# Altium schematic sheet UI_and_IO-Connectors.SchDoc
size A3; SheetNumber: 4; SheetTotal: 8; DocumentSheetName: I/O
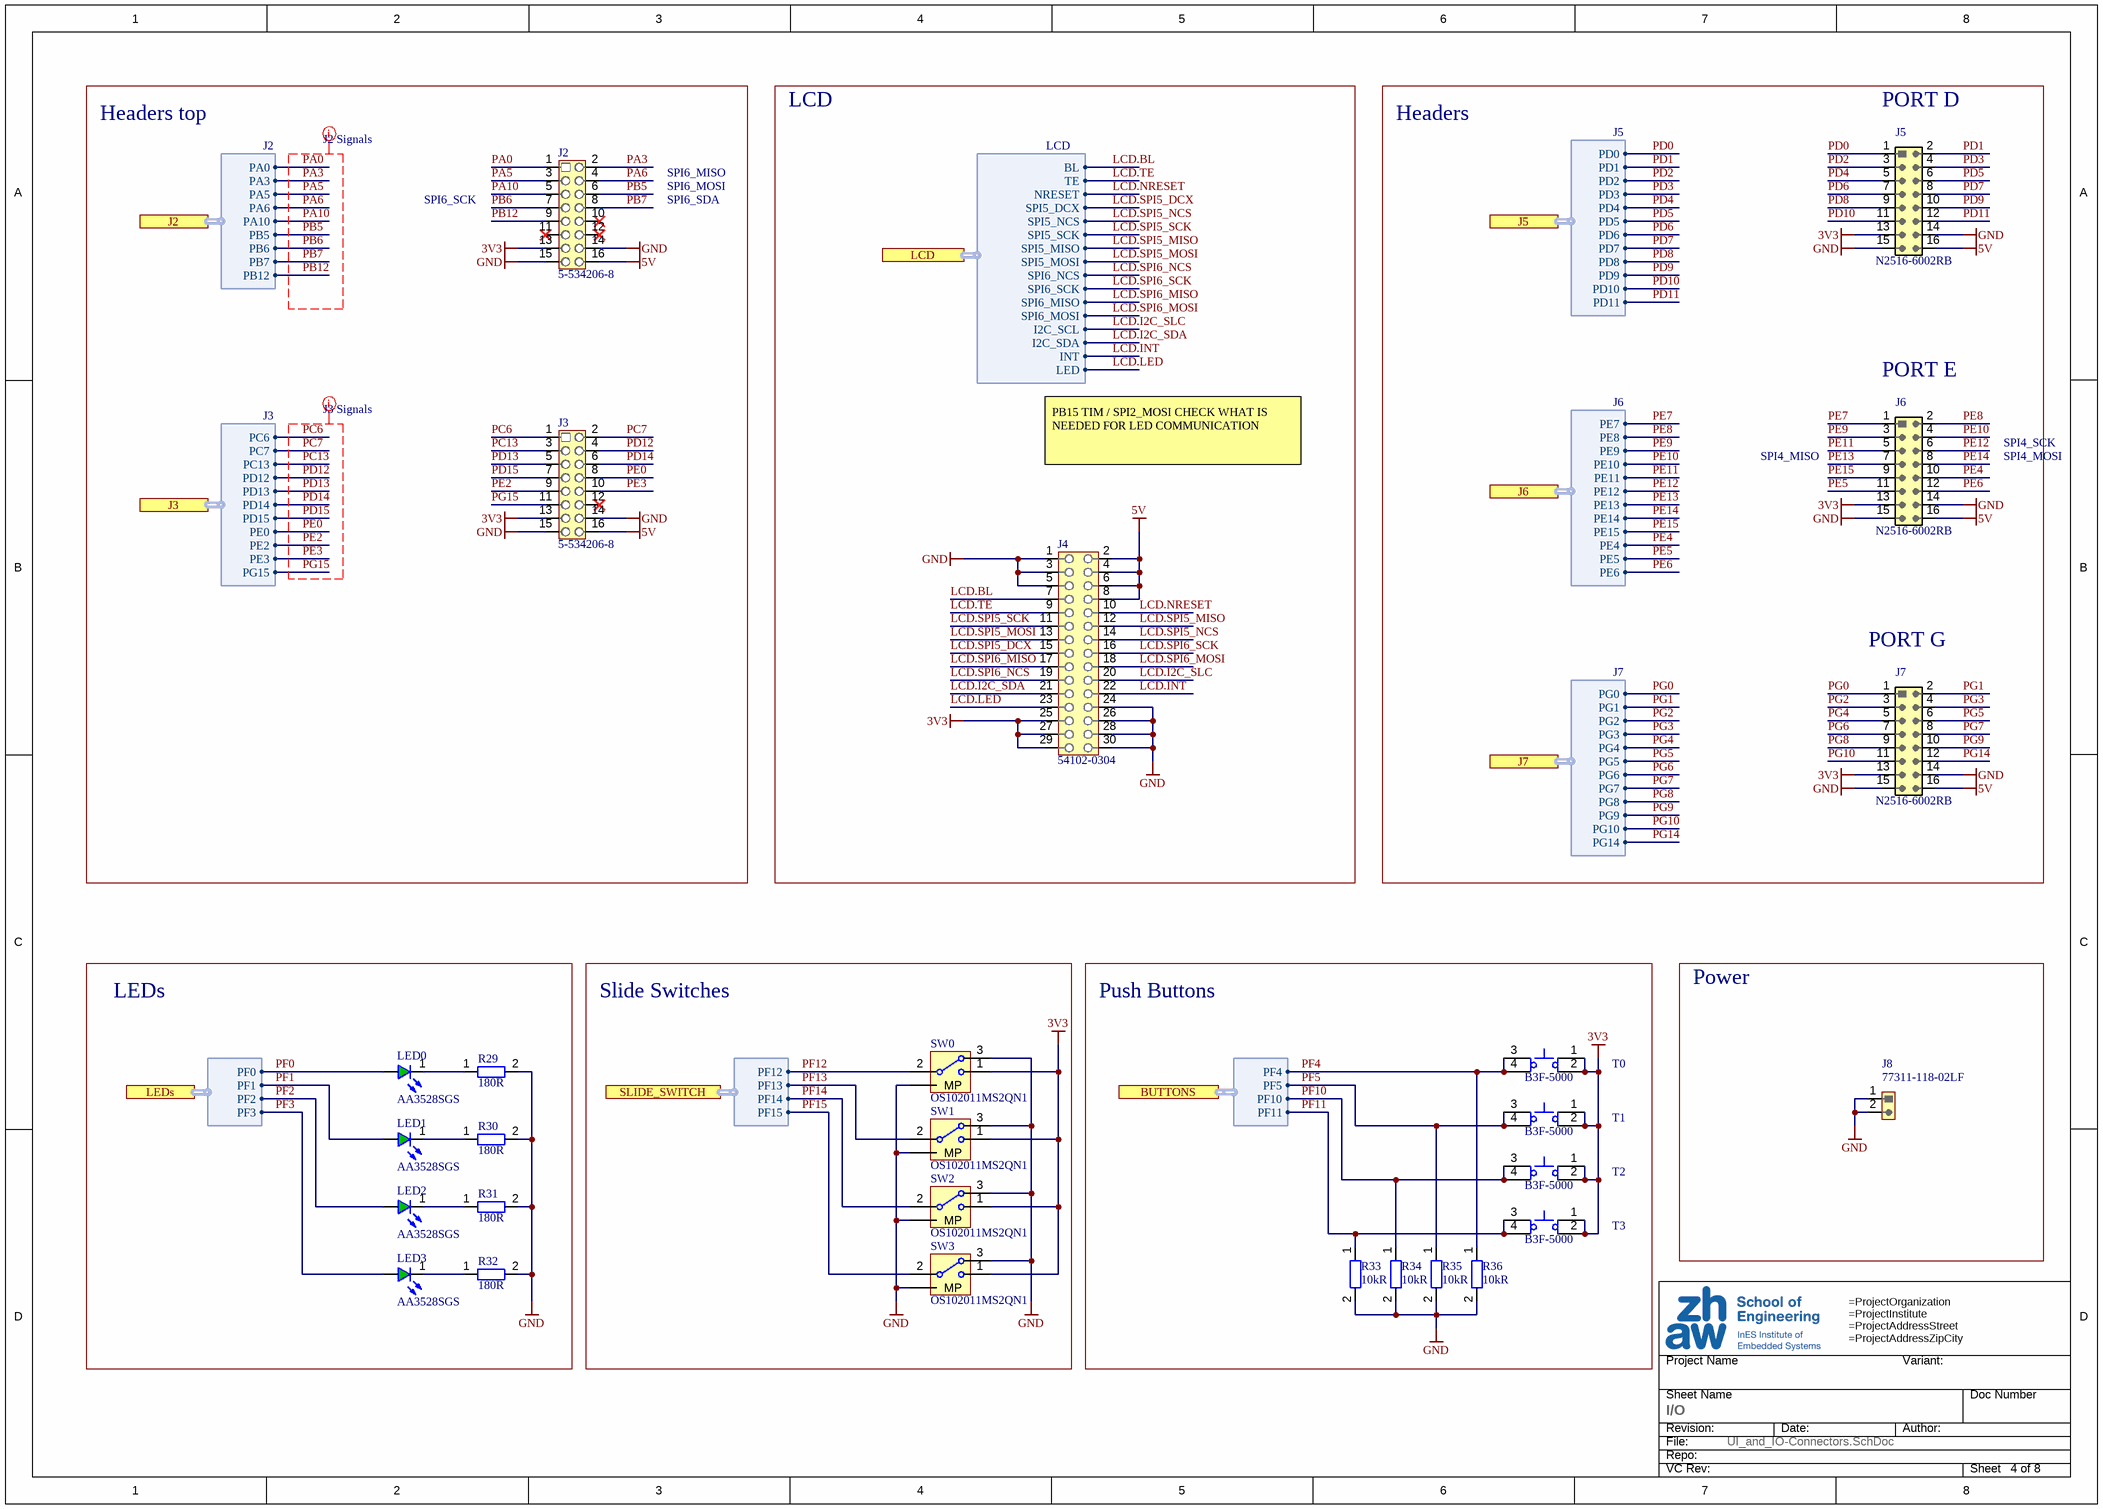
[diagram p0: UI_and_IO-Connectors.SchDoc]

## Parts
J2  5-534206-8  [HD254_2x8_FV_THT]
J3  5-534206-8  [HD254_2x8_FV_THT]
J4  54102-0304  [MOLEX_54102-0304]
J5  N2516-6002RB  [3M-N2516-6002RB]
J6  N2516-6002RB  [3M-N2516-6002RB]
J7  N2516-6002RB  [3M-N2516-6002RB]
J8  77311-118-02LF  [HD254 _1x2_MV]
LED0  AA3528SGS  [LEDM350X280X190-2]
LED1  AA3528SGS  [LEDM350X280X190-2]
LED2  AA3528SGS  [LEDM350X280X190-2]
LED3  AA3528SGS  [LEDM350X280X190-2]
R29  180R  [RESC1608X45N]
R30  180R  [RESC1608X45N]
R31  180R  [RESC1608X45N]
R32  180R  [RESC1608X45N]
R33  10kR  [RESC1005X35N]
R34  10kR  [RESC1005X35N]
R35  10kR  [RESC1005X35N]
R36  10kR  [RESC1005X35N]
SW0  OS102011MS2QN1  [SW_OS102011MS2QN1]
SW1  OS102011MS2QN1  [SW_OS102011MS2QN1]
SW2  OS102011MS2QN1  [SW_OS102011MS2QN1]
SW3  OS102011MS2QN1  [SW_OS102011MS2QN1]
T0  B3F-5000  [SW_B3F-5000]
T1  B3F-5000  [SW_B3F-5000]
T2  B3F-5000  [SW_B3F-5000]
T3  B3F-5000  [SW_B3F-5000]

## Blocks framed on the sheet
Headers top: J2 J3
LCD: J4
LEDs: LED0-LED3 R29-R32
Slide Switches: SW0-SW3
Push Buttons: R33-R36 T0-T3
Power: J8

## Ports
BUTTONS (harness BUTTONS), J2 (harness J2), J3 (harness J3), J5 (harness J5), J6 (harness J6), J7 (harness J7), LCD (harness LCD), LEDs (harness LEDs), SLIDE_SWITCH (harness SLIDE_SWITCH)

## Harnesses
LCD: SPI5_DCX, SPI5_SCK, SPI5_MISO, SPI5_MOSI, SPI5_NCS, SPI6_NCS, TE, SPI6_SCK, SPI6_MOSI, SPI6_MISO, NRESET, I2C_SCL, I2C_SDA, INT, BL, LED
J2: PA0, PA3, PA5, PA6, PA10, PB5, PB6, PB12, PB7
J3: PG15, PC6, PC7, PC13, PD12, PD13, PD14, PD15, PE0, PE2, PE3
J5: PD0, PD1, PD2, PD3, PD4, PD5, PD6, PD7, PD8, PD9, PD10, PD11
J6: PE7, PE8, PE9, PE10, PE11, PE12, PE13, PE14, PE15, PE4, PE5, PE6
J7: PG0, PG1, PG2, PG3, PG4, PG5, PG6, PG7, PG8, PG9, PG10, PG14
LEDs: PF0, PF1, PF2, PF3
SLIDE_SWITCH: PF12, PF13, PF14, PF15
BUTTONS: PF4, PF5, PF10, PF11

## Nets
3V3: J2.13 J3.13 J4.25 J4.27 J4.29 J5.13 J6.13 J7.13 SW0.1(Signal) SW1.1(Signal) SW2.1(Signal) SW3.1(Signal) T0.1 T0.2 T1.1 T1.2 T2.1 T2.2 T3.1 T3.2
5V: J2.16 J3.16 J4.2 J4.4 J4.6 J4.8 J5.16 J6.16 J7.16
GND: J2.14 J2.15 J3.14 J3.15 J4.1 J4.3 J4.5 J4.24 J4.26 J4.28 J4.30 J5.14 J5.15 J6.14 J6.15 J7.14 J7.15 J8.1 J8.2 R29.2 R30.2 R31.2 R32.2 R33.2 R34.2 R35.2 R36.2 SW0.3(Signal) SW0.MP SW1.3(Signal) SW1.MP SW2.3(Signal) SW2.MP SW3.3(Signal) SW3.MP
LCD.BL: J4.7 ; port LCD.BL
LCD.I2C_SDA: J4.21 ; port LCD.I2C_SDA
LCD.I2C_SLC: J4.20 ; port LCD.I2C_SCL
LCD.INT: J4.22 ; port LCD.INT
LCD.LED: J4.23 ; port LCD.LED
LCD.NRESET: J4.10 ; port LCD.NRESET
LCD.SPI5_DCX: J4.15 ; port LCD.SPI5_DCX
LCD.SPI5_MISO: J4.12 ; port LCD.SPI5_MISO
LCD.SPI5_MOSI: J4.13 ; port LCD.SPI5_MOSI
LCD.SPI5_NCS: J4.14 ; port LCD.SPI5_NCS
LCD.SPI5_SCK: J4.11 ; port LCD.SPI5_SCK
LCD.SPI6_MISO: J4.17 ; port LCD.SPI6_MISO
LCD.SPI6_MOSI: J4.18 ; port LCD.SPI6_MOSI
LCD.SPI6_NCS: J4.19 ; port LCD.SPI6_NCS
LCD.SPI6_SCK: J4.16 ; port LCD.SPI6_SCK
LCD.TE: J4.9 ; port LCD.TE
PA0: J2.1 ; port J2.PA0
PA3: J2.2 ; port J2.PA3
PA5: J2.3 ; port J2.PA5
PA6: J2.4 ; port J2.PA6
PA10: J2.5 ; port J2.PA10
PB5: J2.6 ; port J2.PB5
PB6: J2.7 ; port J2.PB6
PB7: J2.8 ; port J2.PB7
PB12: J2.9 ; port J2.PB12
PC6: J3.1 ; port J3.PC6
PC7: J3.2 ; port J3.PC7
PC13: J3.3 ; port J3.PC13
PD0: J5.1 ; port J5.PD0
PD1: J5.2 ; port J5.PD1
PD2: J5.3 ; port J5.PD2
PD3: J5.4 ; port J5.PD3
PD4: J5.5 ; port J5.PD4
PD5: J5.6 ; port J5.PD5
PD6: J5.7 ; port J5.PD6
PD7: J5.8 ; port J5.PD7
PD8: J5.9 ; port J5.PD8
PD9: J5.10 ; port J5.PD9
PD10: J5.11 ; port J5.PD10
PD11: J5.12 ; port J5.PD11
PD12: J3.4 ; port J3.PD12
PD13: J3.5 ; port J3.PD13
PD14: J3.6 ; port J3.PD14
PD15: J3.7 ; port J3.PD15
PE0: J3.8 ; port J3.PE0
PE2: J3.9 ; port J3.PE2
PE3: J3.10 ; port J3.PE3
PE4: J6.10 ; port J6.PE4
PE5: J6.11 ; port J6.PE5
PE6: J6.12 ; port J6.PE6
PE7: J6.1 ; port J6.PE7
PE8: J6.2 ; port J6.PE8
PE9: J6.3 ; port J6.PE9
PE10: J6.4 ; port J6.PE10
PE11: J6.5 ; port J6.PE11
PE12: J6.6 ; port J6.PE12
PE13: J6.7 ; port J6.PE13
PE14: J6.8 ; port J6.PE14
PE15: J6.9 ; port J6.PE15
PF0: LED0.2(A) ; port LEDs.PF0
PF1: LED1.2(A) ; port LEDs.PF1
PF2: LED2.2(A) ; port LEDs.PF2
PF3: LED3.2(A) ; port LEDs.PF3
PF4: R36.1 T0.3 T0.4 ; port BUTTONS.PF4
PF5: R35.1 T1.3 T1.4 ; port BUTTONS.PF5
PF10: R34.1 T2.3 T2.4 ; port BUTTONS.PF10
PF11: R33.1 T3.3 T3.4 ; port BUTTONS.PF11
PF12: SW0.2(COM) ; port SLIDE_SWITCH.PF12
PF13: SW1.2(COM) ; port SLIDE_SWITCH.PF13
PF14: SW2.2(COM) ; port SLIDE_SWITCH.PF14
PF15: SW3.2(COM) ; port SLIDE_SWITCH.PF15
PG0: J7.1 ; port J7.PG0
PG1: J7.2 ; port J7.PG1
PG2: J7.3 ; port J7.PG2
PG3: J7.4 ; port J7.PG3
PG4: J7.5 ; port J7.PG4
PG5: J7.6 ; port J7.PG5
PG6: J7.7 ; port J7.PG6
PG7: J7.8 ; port J7.PG7
PG8: J7.9 ; port J7.PG8
PG9: J7.10 ; port J7.PG9
PG10: J7.11 ; port J7.PG10
PG14: J7.12 ; port J7.PG14
PG15: J3.11 ; port J3.PG15
NetLED0_1: LED0.1(K) R29.1
NetLED1_1: LED1.1(K) R30.1
NetLED2_1: LED2.1(K) R31.1
NetLED3_1: LED3.1(K) R32.1

Not connected (* = marked no-connect by the designer): J2 10* 11* 12*; J3 12*

## Layout directives
net class J2 Signals: PA0, PA3, PA5, PA6, PA10, PB5, PB6, PB7, PB12
net class J3 Signals: PC6, PC7, PC13, PD12, PD13, PD14, PD15, PE0, PE2, PE3, PG15

## Notes on the sheet
- (near J5) PORT D
- SPI6_MISO
- Headers
- SPI6_SCK
- SPI6_MOSI
- SPI6_SDA
- (near J6) PORT E
- SPI4_SCK
- PB15 TIM / SPI2_MOSI CHECK WHAT IS NEEDED FOR LED COMMUNICATION
- SPI4_MISO
- SPI4_MOSI
- (near J7) PORT G
- Sheet Name
- Project Name
- Variant:
- Doc Number
- File:
- Repo:
- Revision:
- Date:
- Author:
- VC Rev:
- Sheet

## Library data of the parts
J2 J3 = CMP-00636-4: Header, 2x8Pin, Pitch 2.54mm, Female, Vertical, THT; Manufacturer: TE Connectivity; Mating Length: 8.36m; Plating: Gold; Pin Mapping: 2x8; Angle: Vertical; Insulation Height: 8.64m; Pitch: 2.54mm; Pins: 16; Gender: Female; Pitch Row: 2.54mm; Mounting Technology: THT
J4 = CMP-001-0083-9: Board to Board, SlimStack, 2x15 Pin, Pitch 0.5mm, Female, 0.5A, 50V, Vertical, SMD, L10.1B4.1H2; Manufacturer: Molex; Mating Part: 500334, 53885; Pitch: 500µm; Connection: Pluggable; Max Current: 500mA; Pin Mapping: 2x15; Mounting Technology: SMD; Pins: 30; Angle: Vertical; Size: L10.1B4.1H2; Family Name: SlimStack; Gender: Female; Type: Board to Board; Max Voltage: 50V
J5-J7 = CMP-00747-6: Box Header 4-Wall, 2x8 Pin, Pitch 2.54mm, Male, Vertical, THT, L27.64b8.59H9.91; Manufacturer: 3M; Connection: Pluggable; Pins: 16; Gender: Male; Type: Wire to Board; Size: L25.6B8.59H9.91; Angle: Vertical; Pitch: 2.54mm; Mounting Technology: THT
J8 = CMP-002-00113-16: Header, 1x2 Pin, Pitch 2.54mm, Male, Vertical, THT; Manufacturer: FCI; Overall Contact Length: 11.43mm; Mating Length: 5.84mm; Pins: 2; Angle: Vertical; Pitch Row: 2.54mm; Pitch: 2.54mm; Gender: Male; Insulation Height: 2.54mm; Mounting Technology: THT; Pin Mapping: 1x2; Termination Length: 3.05mm
LED0-LED3 = CMP-00744-7: LED, green 565nm, 25mA, 2.2V, L3.5B2.8H1.9; Size: L3.5B2.8H1.9; Forward Voltage: 2.2V; Color: Green; Case/Package: SMD-2; Rated Current: 25mA; Wavelength: 565nm; Mounting Technology: SMD
R29-R32 = CMP-009-00559-5: Res, 180R, 1%, 100mW, 0603; Voltage Rating: 75V; Value: 180; Mounting Technology: SMD; Case Code (Metric): 1608; Power: 100mW; Type: Fixed; Case/Package: 0603; Tolerance: 1%
R33-R36 = CMP-009-00298-12: Res, 10kR, 1%, 0.063W, 0402; Value: 10k; Power: 63mW; Voltage Rating: 50V; Tolerance: 1%; Type: Fixed; Case Code (Metric): 1005; Case/Package: 0402; Mounting Technology: SMD
SW0-SW3 = CMP-00742-3: Slide Switch, Vertical, SPDT 2P, 12V, 100mA, L8.6B4.3H8; Illuminated: No; Number of Positions: 2; Angle: Vertical; Size: L8.6B4.3H8; Contact Form: SPDT; Current Rating: 100mA; Actuation: Slide; Type: Switch; Mounting Technology: THT; Contact Material: Silver; Voltage Rating: 12V
T0-T3 = CMP-00738-5: Push Button, Vertical, SPST-NO, 4P, 24V, 50mA, L12B12H4.3; Contact Form: SPST; Number of Positions: 4; Pitch: 5; Illuminated: No; Mounting Technology: THT; Size: L12B12H4.3; Current Rating: 50mA; Voltage Rating: 24V; Angle: Vertical; Actuation: Push; Contact Material: Silver; Type: Button